# EAGLE design RaspShield (EAGLE 7.3.0)
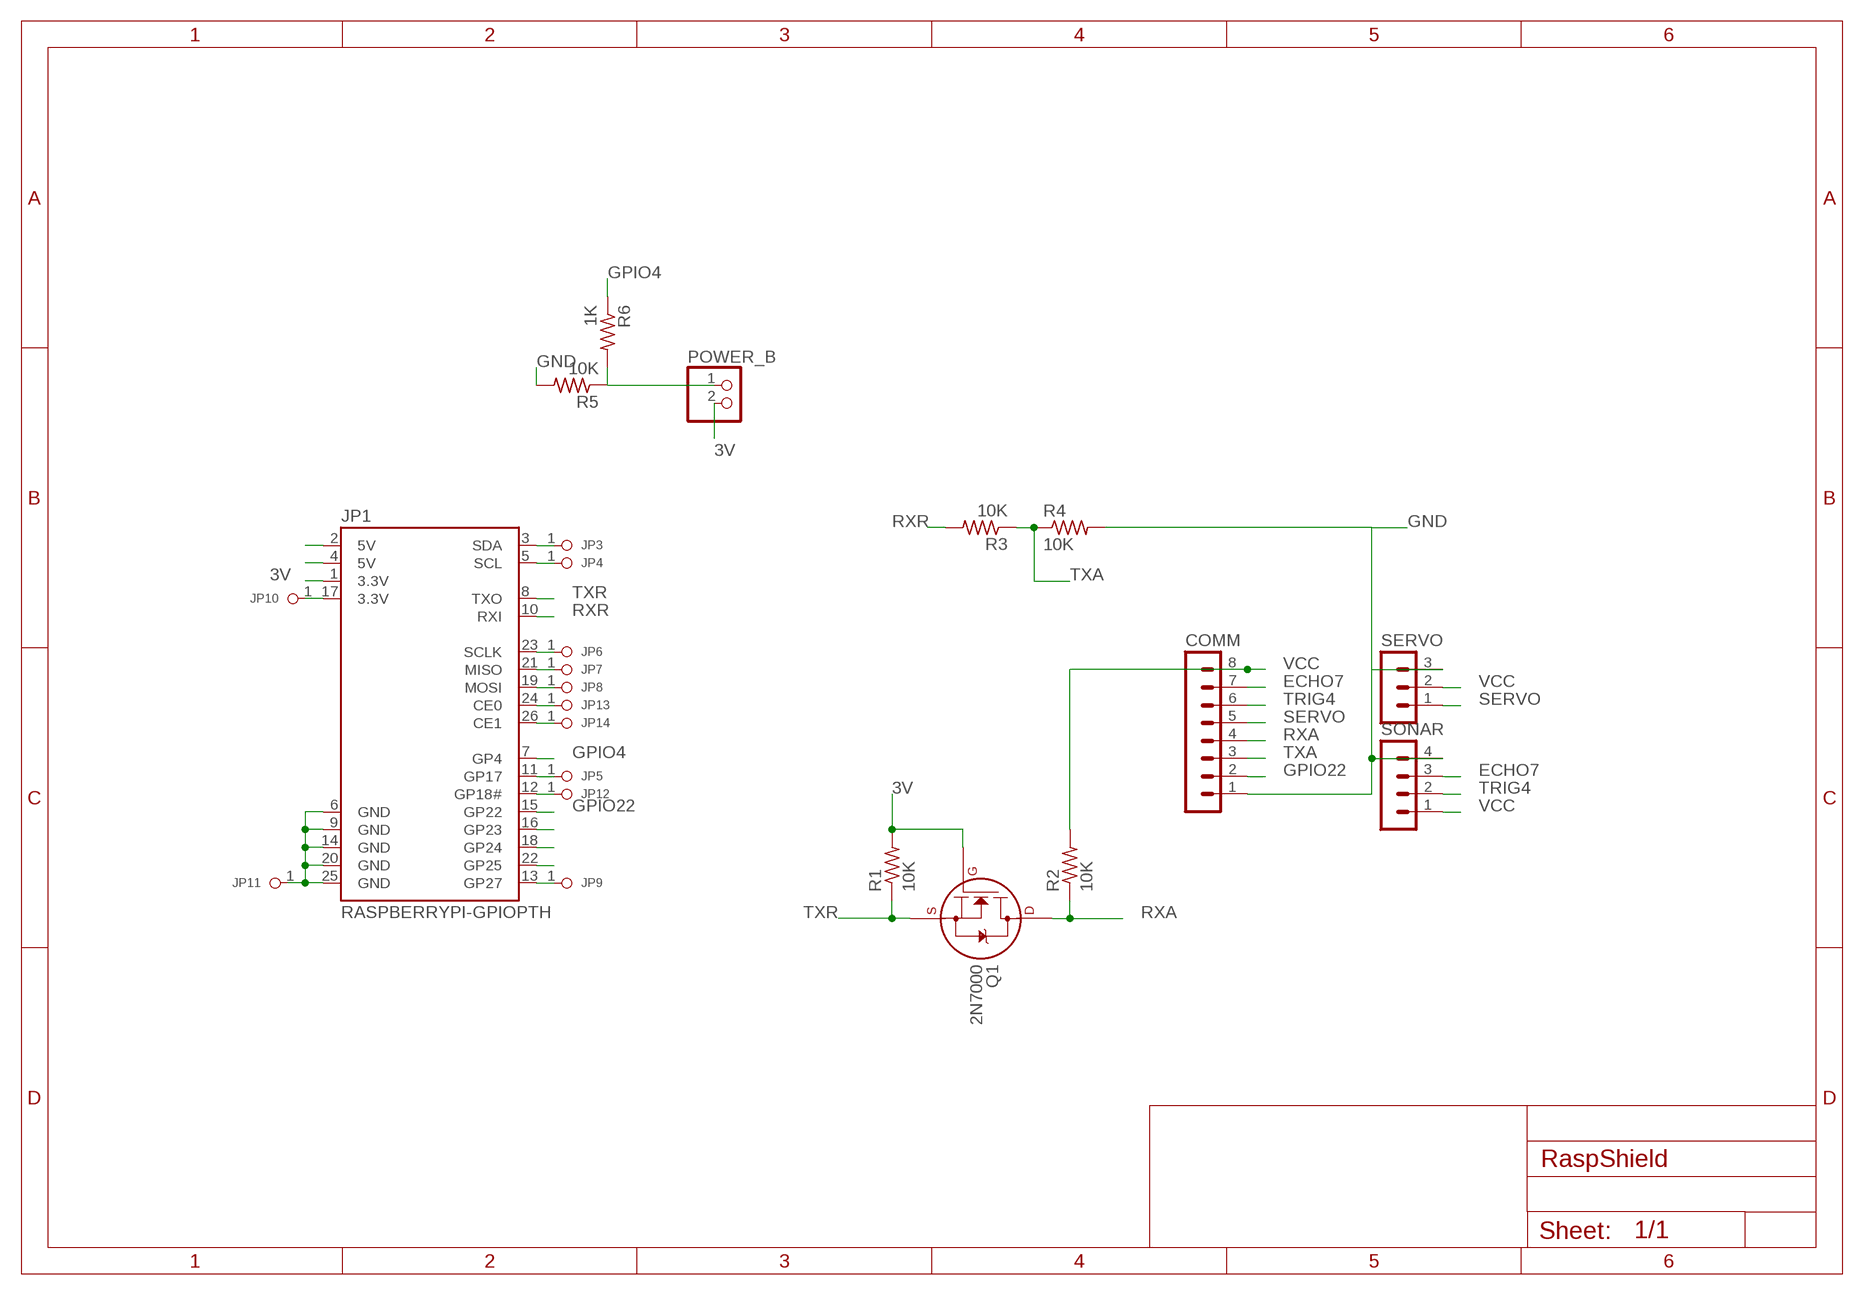
[diagram p0: schematic, sheet 1]

## Parts
COMM  MA08-1  [MA08-1]
JP1  RASPBERRYPI-GPIOPTH  [2X13-SHROUDED]
JP3  PINHD-1X1  [1X01]
JP4  PINHD-1X1  [1X01]
JP5  PINHD-1X1  [1X01]
JP6  PINHD-1X1  [1X01]
JP7  PINHD-1X1  [1X01]
JP8  PINHD-1X1  [1X01]
JP9  PINHD-1X1  [1X01]
JP10  PINHD-1X1  [1X01]
JP11  PINHD-1X1  [1X01]
JP12  PINHD-1X1  [1X01]
JP13  PINHD-1X1  [1X01]
JP14  PINHD-1X1  [1X01]
POWER_B  PINHD-1X2  [1X02]
Q1  2N7000  2N7000_TO92  [TO-92]
R1  10K  R-US_0207/7  [0207/7]
R2  10K  R-US_0207/7  [0207/7]
R3  10K  R-US_0207/7  [0207/7]
R4  10K  R-US_0207/7  [0207/7]
R5  10K  R-US_0207/7  [0207/7]
R6  1K  R-US_0207/7  [0207/7]
SERVO  MA03-1  [MA03-1]
SONAR  MA04-1  [MA04-1]

## Nets
3V: JP1.1(3.3V) POWER_B.2 Q1.2(G) R1.2
ECHO7: COMM.7 SONAR.3
GND: COMM.1 R4.2 R5.2 SERVO.3 SONAR.4
GP2: JP1.3(SDA) JP3.1
GP3: JP1.5(SCL) JP4.1
GP7: JP1.26(CE1) JP14.1
GP8: JP1.24(CE0) JP13.1
GP9: JP1.21(MISO) JP7.1
GP10: JP1.19(MOSI) JP8.1
GP11: JP1.23(SCLK) JP6.1
GP17: JP1.11(GP17) JP5.1
GP18: JP1.12(GP18#) JP12.1
GP23: JP1.16(GP23)
GP24: JP1.18(GP24)
GP25: JP1.22(GP25)
GP27: JP1.13(GP27) JP9.1
GPIO4: JP1.7(GP4) R6.1
GPIO22: COMM.2 JP1.15(GP22)
N$1: JP1.17(3.3V) JP10.1
N$2: POWER_B.1 R5.1 R6.2
N$4: JP1.6(GND) JP1.9(GND) JP1.14(GND) JP1.20(GND) JP1.25(GND) JP11.1
N$15: JP1.4(5V)
N$16: JP1.2(5V)
RXA: COMM.4 Q1.3(D) R2.1
RXR: JP1.10(RXI) R3.2
SERVO: COMM.5 SERVO.1
TRIG4: COMM.6 SONAR.2
TXA: COMM.3 R3.1 R4.1
TXR: JP1.8(TXO) Q1.1(S) R1.1
VCC: COMM.8 R2.2 SERVO.2 SONAR.1

## Library data of the parts
COMM = con-lstb:MA08-1: PIN HEADER; OC_FARNELL: unknown; OC_NEWARK: unknown
JP1 = SparkFun-Boards:RASPBERRYPI-GPIO: RASPBERRY PI I/O HEADER As defined for the Revistion 2 Pi.; DIST: sparkfun; DIST_ID: PRT-11490
JP3-JP14 = adafruit:PINHD-1X1: Pin header 1x1 for 0.1" spacing With round pins
POWER_B = pinhead:PINHD-1X2: PIN HEADER
Q1 = transistors:2N700*: 2N7000, 2N7002, NDS7002A N-channel enhancement mode MOSFET
R1-R6 = adafruit:R-US_: RESISTOR, American symbol
SERVO = con-lstb:MA03-1: PIN HEADER; OC_FARNELL: unknown; OC_NEWARK: unknown
SONAR = con-lstb:MA04-1: PIN HEADER; OC_FARNELL: unknown; OC_NEWARK: unknown

## Board
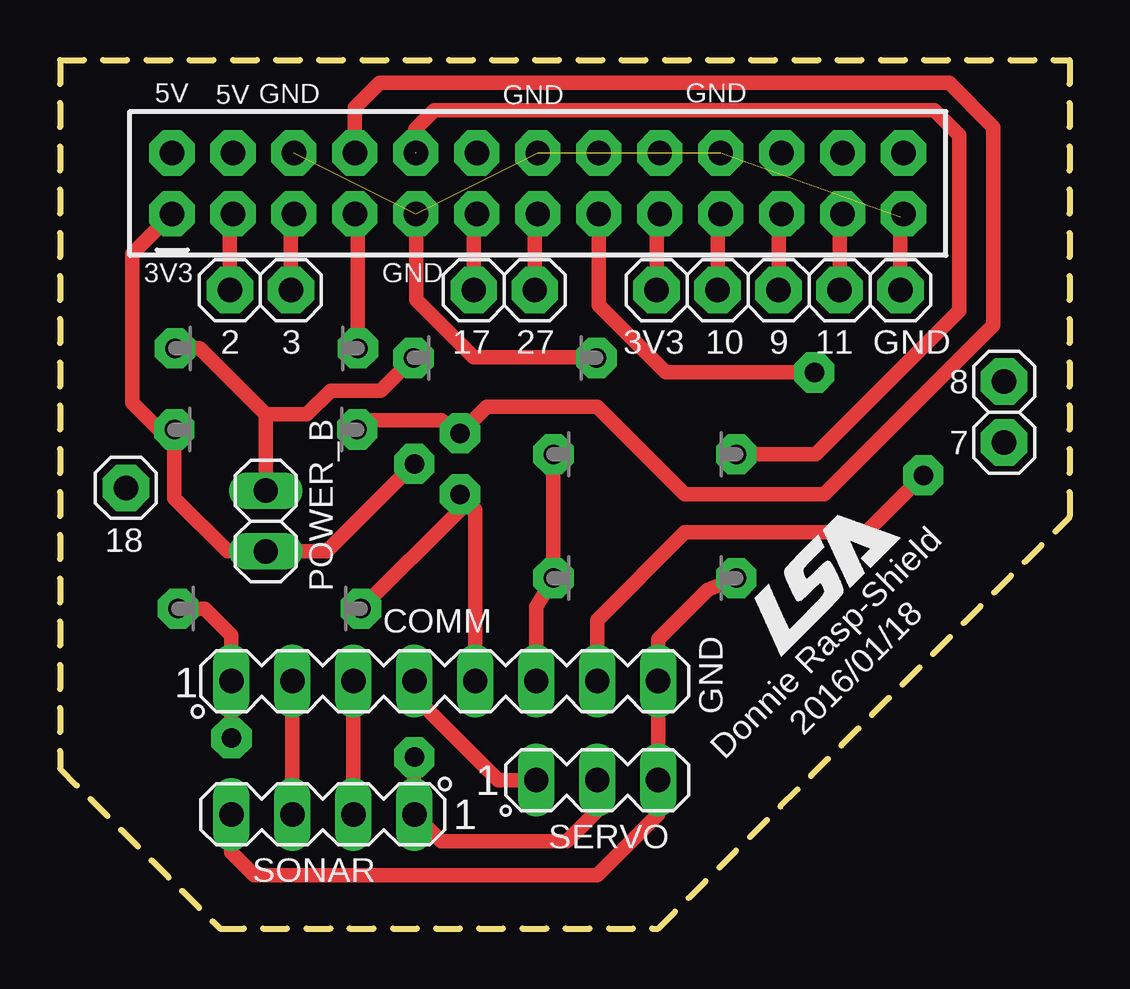
[diagram p1: board, top side]
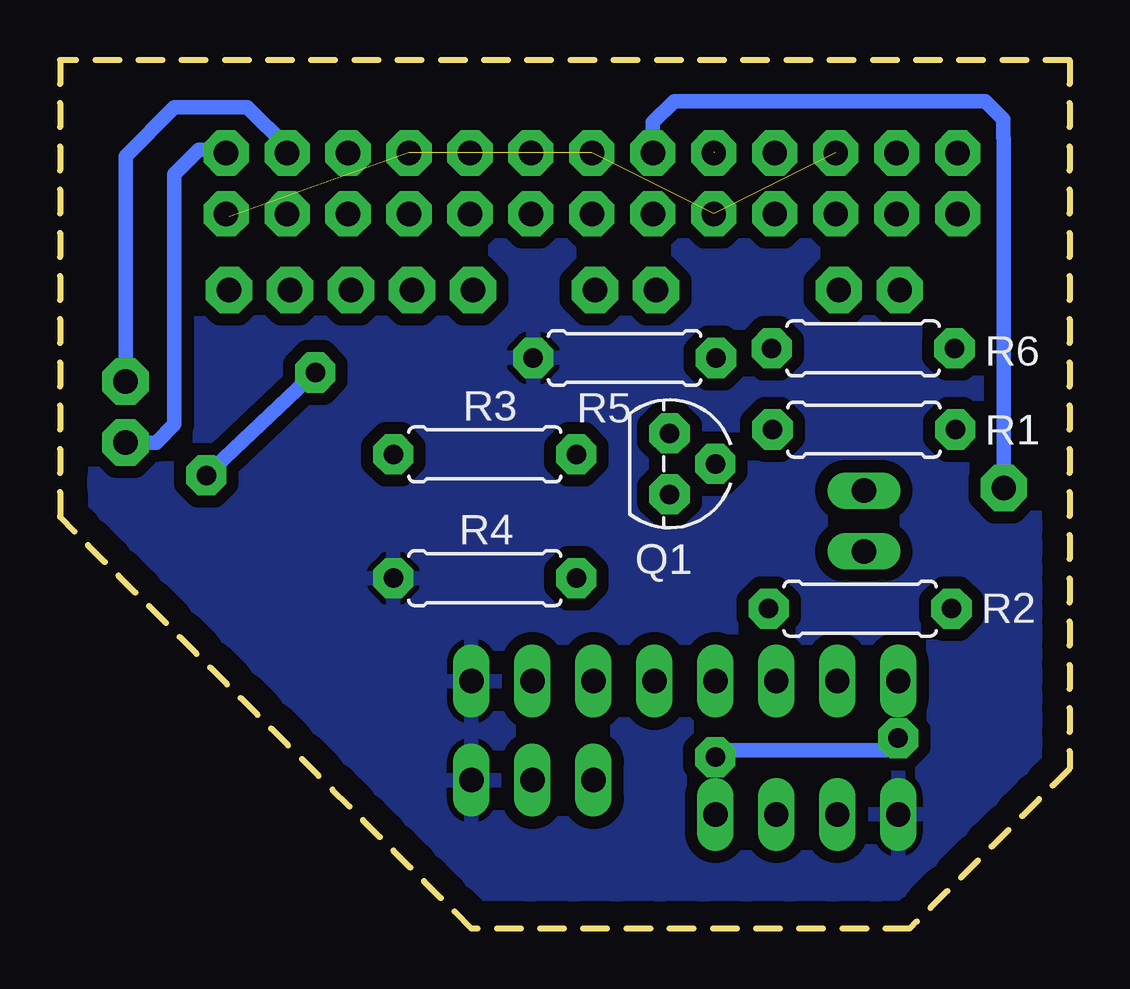
[diagram p2: board, bottom side, seen from below]

Size 42.07 x 36.2 mm. Coordinates in mm from the lower left corner, seen from the top.
Outline: 0,36.2 42.07,36.2 42.07,17.15 24.92,0 6.67,0 0,6.67 0,36.2
Copper layers (1*16): Top 0.035mm / dielectric 1.5mm / Bottom 0.035mm
Design rules "default *": minimum track width 24mil, minimum drill 24mil, track to track 20mil, track to pad 20mil, pad to pad 20mil, via to via 20mil, smd to smd 20mil, copper to edge 40mil, drill to drill 8mil, minimum pad ring 10mil, minimum via ring 8mil, stop-mask expansion 4mil, vias tented up to drill 0mil, thermal gap 10mil

### Footprints (pad centres in the part's own frame; a part is rotated, then mirrored left to right if it is on the bottom)
MA08-1 = drill 1.016 long: 1 -8.89,0; 2 -6.35,0; 3 -3.81,0; 4 -1.27,0; 5 1.27,0; 6 3.81,0; 7 6.35,0; 8 8.89,0
2X13-SHROUDED = drill 1.016 pad 1.88 octagon: 1 -1.27,15.24; 2 1.27,15.24; 3 -1.27,12.7; 4 1.27,12.7; 5 -1.27,10.16; 6 1.27,10.16; 7 -1.27,7.62; 8 1.27,7.62; 9 -1.27,5.08; 10 1.27,5.08; 11 -1.27,2.54; 12 1.27,2.54; 13 -1.27,0; 14 1.27,0; 15 -1.27,-2.54; 16 1.27,-2.54; 17 -1.27,-5.08; 18 1.27,-5.08; 19 -1.27,-7.62; 20 1.27,-7.62; 21 -1.27,-10.16; 22 1.27,-10.16; 23 -1.27,-12.7; 24 1.27,-12.7; 25 -1.27,-15.24; 26 1.27,-15.24
1X01 = drill 1.016 pad 1.93 octagon: 1 0,0
1X02 = drill 1.016 long: 1 -1.27,0; 2 1.27,0
TO-92 = drill 0.813 pad 1.676 octagon: 1 -1.27,0; 2 0,1.905; 3 1.27,0
0207/7 = drill 0.813 pad 1.676 octagon: 1 -3.81,0; 2 3.81,0
MA03-1 = drill 1.016 long: 1 -2.54,0; 2 0,0; 3 2.54,0
MA04-1 = drill 1.016 long: 1 -3.81,0; 2 -1.27,0; 3 1.27,0; 4 3.81,0

### Placement (x,y rotation side)
COMM  16.03,10.32 180 top
JP1  19.91,31.05 90 top
JP3  7.08,26.61 0 top
JP4  9.62,26.61 0 top
JP5  17.24,26.61 0 top
JP6  32.48,26.61 0 top
JP7  29.94,26.61 0 top
JP8  27.4,26.61 0 top
JP9  19.78,26.61 0 top
JP10  24.86,26.61 0 top
JP11  35.02,26.61 0 top
JP12  2.75,18.37 0 top
JP13  39.34,22.8 0 top
JP14  39.34,20.26 0 top
POWER_B  8.57,16.99 270 top
Q1  16.67,19.37 270 bottom
R1  8.57,20.8 180 top
R2  8.73,13.34 180 top
R3  24.37,19.76 0 top
R4  24.37,14.61 0 top
R5  18.54,23.78 0 top
R6  8.6,24.18 180 top
SERVO  22.38,6.19 0 top
SONAR  10.95,4.76 180 top

### Tracks (layer width: path | path; a pad name or v marks a point on that pad's centre or on a via)
3V
  Top 0.61: Q1.2 11.11,15.72 POWER_B.2 6.99,15.72 4.76,17.94 R1.2 4.13,20.8 3.02,21.91 3.02,28.13 JP1.1
ECHO7
  Top 0.61: COMM.7 SONAR.3
GND
  Top 0.61: SONAR.4 7.14,3.17 8.1,2.22 22.38,2.22 24.92,4.76 SERVO.3 COMM.1 24.92,12.06 26.99,14.13 R4.2 | 14.85,29.76 14.85,26.2 17.24,23.81 22.32,23.81 R5.2
  pour Bottom: 0.48,6.79 0.48,35.75 41.62,35.75 41.62,17.46 24.61,0.44 6.83,0.44
GP2
  Top 0.61: JP3.1 7.08,29.65 JP1.3
GP3
  Top 0.61: JP4.1 9.62,29.65 JP1.5
GP7
  Bottom 0.61: JP1.26 35.27,32.45 36.29,32.45 37.31,31.43 37.31,21.02 38.07,20.26 JP14.1
GP8
  Bottom 0.61: JP1.24 32.61,32.58 34.26,34.23 37.31,34.23 39.34,32.19 JP13.1
GP9
  Top 0.61: JP7.1 29.94,29.65 JP1.21
GP10
  Top 0.61: JP8.1 27.4,29.65 JP1.19
GP11
  Top 0.61: JP6.1 32.48,29.65 JP1.23
GP17
  Top 0.61: JP5.1 17.24,29.65 JP1.11
GP18
  Bottom 0.61: JP1.12 17.37,33.59 16.48,34.48 3.52,34.48 2.76,33.72 2.76,32.96 2.75,32.94 JP12.1
GP27
  Top 0.61: JP9.1 19.78,29.65 JP1.13
GPIO4
  Top 0.61: R6.1 12.41,29.65 JP1.7
GPIO22  (via drill 0.81 pad 1.68)
  Top 0.61: COMM.2 22.38,12.86 26.04,16.51 33.59,16.51 v35.97,18.89 | JP1.15 22.45,25.97 25.24,23.18 v31.43,23.18
  Bottom 0.61: v31.43,23.18 v35.97,18.89
N$1
  Top 0.61: JP10.1 24.86,29.65 JP1.17
N$2
  Top 0.61: POWER_B.1 8.57,21.43 | 8.57,21.43 5.82,24.18 R6.2 | R5.1 13.37,22.42 11.27,22.42 10.29,21.43 8.57,21.43
N$4  (4 unrouted)
  Top 0.61: JP11.1 35.02,29.65 JP1.25
RXA
  Top 0.61: R2.1 16.67,17.46 Q1.3 17.3,17.46 COMM.4
RXR  (1 unrouted)
  Top 0.61: R3.2 31.48,19.76 37.47,25.75 37.47,33.05 36.42,34.1 15.59,34.1 14.8,33.31 14.8,32.35
SERVO
  Top 0.61: COMM.5 14.76,9.68 18.26,6.19 SERVO.1
TRIG4
  Top 0.61: COMM.6 SONAR.2
TXA
  Top 0.61: R3.1 R4.1 19.84,13.41 COMM.3
TXR
  Top 0.61: R1.1 13.02,21.18 15.88,21.18 Q1.1 17.78,21.75 22.38,21.75 26.04,18.1 31.85,18.1 38.89,25.15 38.89,33.4 37.05,35.24 13.33,35.24 12.29,34.2 JP1.8
VCC  (via drill 0.81 pad 1.68)
  Top 0.61: R2.2 6.03,13.34 7.14,12.22 COMM.8 v7.14,7.94 | v14.76,7.14 SONAR.1 15.88,3.65 21.11,3.65 22.38,4.92 SERVO.2
  Bottom 0.61: v14.76,7.14 14.48,7.43 7.65,7.43 v7.14,7.94

### Text on the board
tPlace: 2016/01/18 | Donnie Rasp-Shield
tNames: 2 | 3 | 17 | 27 | 3V3 | 10 | 9 | 11 | GND | 8 | 7 | 18 | GND